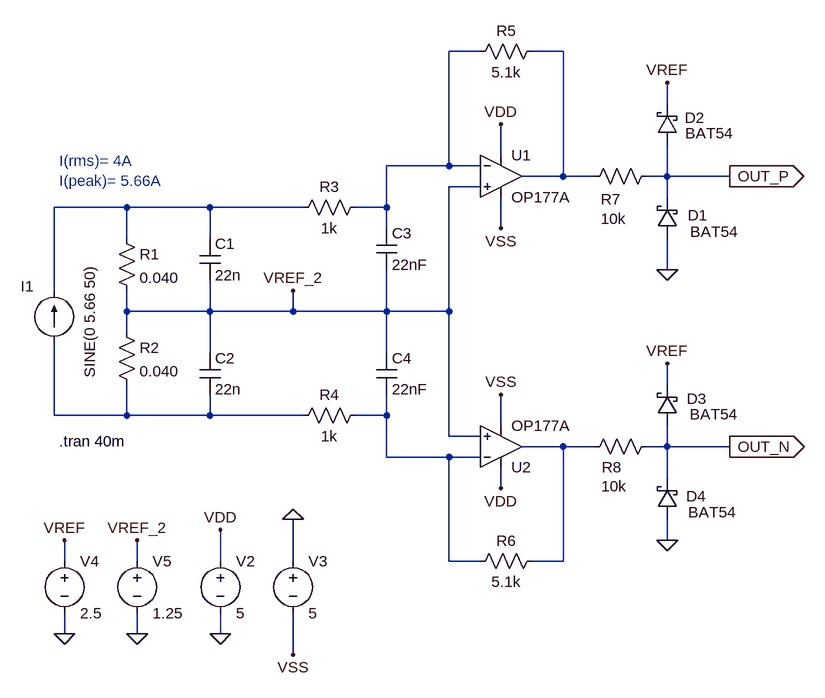
[diagram p0: schematic v1.0.asc]
v1.0.asc, the LTspice schematic file:
Version 4.1
SHEET 1 1828 1004
WIRE 800 -208 752 -208
WIRE 928 -208 880 -208
WIRE 1088 -128 1088 -160
WIRE 832 -48 832 -96
WIRE 752 -32 752 -208
WIRE 752 -32 656 -32
WIRE 800 -32 752 -32
WIRE 928 -16 928 -208
WIRE 928 -16 864 -16
WIRE 976 -16 928 -16
WIRE 1088 -16 1088 -64
WIRE 1088 -16 1056 -16
WIRE 1184 -16 1088 -16
WIRE 800 0 752 0
WIRE 1088 16 1088 -16
WIRE 256 32 144 32
WIRE 384 32 256 32
WIRE 528 32 384 32
WIRE 656 32 656 -32
WIRE 656 32 608 32
WIRE 656 64 656 32
WIRE 832 64 832 16
WIRE 256 80 256 32
WIRE 384 80 384 32
WIRE 1088 128 1088 80
WIRE 144 160 144 32
WIRE 256 192 256 160
WIRE 384 192 384 144
WIRE 384 192 256 192
WIRE 512 192 512 160
WIRE 512 192 384 192
WIRE 656 192 656 128
WIRE 656 192 512 192
WIRE 752 192 752 0
WIRE 752 192 656 192
WIRE 256 224 256 192
WIRE 384 256 384 192
WIRE 656 256 656 192
WIRE 1088 304 1088 272
WIRE 144 352 144 240
WIRE 256 352 256 304
WIRE 256 352 144 352
WIRE 384 352 384 320
WIRE 384 352 256 352
WIRE 528 352 384 352
WIRE 656 352 656 320
WIRE 656 352 608 352
WIRE 832 368 832 320
WIRE 752 384 752 192
WIRE 800 384 752 384
WIRE 928 400 864 400
WIRE 976 400 928 400
WIRE 1088 400 1088 368
WIRE 1088 400 1056 400
WIRE 1184 400 1088 400
WIRE 656 416 656 352
WIRE 752 416 656 416
WIRE 800 416 752 416
WIRE 1088 448 1088 400
WIRE 832 464 832 432
WIRE 1088 544 1088 512
WIRE 160 576 160 544
WIRE 272 576 272 544
WIRE 400 576 400 528
WIRE 512 576 512 512
WIRE 752 576 752 416
WIRE 800 576 752 576
WIRE 928 576 928 400
WIRE 928 576 880 576
WIRE 160 688 160 656
WIRE 272 688 272 656
WIRE 400 688 400 656
WIRE 512 720 512 656
FLAG 1184 -16 OUT_P
IOPIN 1184 -16 Out
FLAG 1184 400 OUT_N
IOPIN 1184 400 Out
FLAG 400 688 0
FLAG 400 528 VDD
FLAG 832 -96 VDD
FLAG 832 464 VDD
FLAG 512 720 VSS
FLAG 832 64 VSS
FLAG 832 320 VSS
FLAG 1088 544 0
FLAG 1088 128 0
FLAG 160 688 0
FLAG 160 544 VREF
FLAG 272 688 0
FLAG 272 544 VREF_2
FLAG 512 160 VREF_2
FLAG 1088 -160 VREF
FLAG 1088 272 VREF
FLAG 512 512 0
SYMBOL current 144 240 R180
WINDOW 0 31 87 Left 2
WINDOW 3 -55 -54 VRight 2
WINDOW 123 0 0 Left 0
WINDOW 39 0 0 Left 0
SYMATTR InstName I1
SYMATTR Value SINE(0 5.66 50)
SYMBOL res 240 64 R0
SYMATTR InstName R1
SYMATTR Value 0.040
SYMBOL res 240 208 R0
SYMATTR InstName R2
SYMATTR Value 0.040
SYMBOL cap 368 80 R0
SYMATTR InstName C1
SYMATTR Value 22n
SYMBOL cap 368 256 R0
SYMATTR InstName C2
SYMATTR Value 22n
SYMBOL res 624 16 R90
WINDOW 0 0 56 VBottom 2
WINDOW 3 32 56 VTop 2
SYMATTR InstName R3
SYMATTR Value 1k
SYMBOL res 624 336 R90
WINDOW 0 0 56 VBottom 2
WINDOW 3 32 56 VTop 2
SYMATTR InstName R4
SYMATTR Value 1k
SYMBOL cap 640 64 R0
SYMATTR InstName C3
SYMATTR Value 22nF
SYMBOL cap 640 256 R0
SYMATTR InstName C4
SYMATTR Value 22nF
SYMBOL OpAmps\\OP177A 832 -80 R0
SYMATTR InstName U1
SYMBOL OpAmps\\OP177A 832 464 M180
SYMATTR InstName U2
SYMBOL voltage 400 560 R0
WINDOW 123 0 0 Left 0
WINDOW 39 0 0 Left 0
SYMATTR InstName V2
SYMATTR Value 5
SYMBOL voltage 512 560 R0
WINDOW 123 0 0 Left 0
WINDOW 39 0 0 Left 0
SYMATTR InstName V3
SYMATTR Value 5
SYMBOL res 896 -224 R90
WINDOW 0 0 56 VBottom 2
WINDOW 3 32 56 VTop 2
SYMATTR InstName R5
SYMATTR Value 5.1k
SYMBOL res 896 560 R90
WINDOW 0 0 56 VBottom 2
WINDOW 3 32 56 VTop 2
SYMATTR InstName R6
SYMATTR Value 5.1k
SYMBOL res 1072 -32 R90
WINDOW 0 67 71 VBottom 2
WINDOW 3 66 67 VTop 2
SYMATTR InstName R7
SYMATTR Value 10k
SYMBOL res 1072 384 R90
WINDOW 0 63 69 VBottom 2
WINDOW 3 61 66 VTop 2
SYMATTR InstName R8
SYMATTR Value 10k
SYMBOL schottky 1104 512 R180
WINDOW 0 -44 36 Left 2
WINDOW 3 -90 11 Left 2
SYMATTR InstName D4
SYMATTR Value BAT54
SYMBOL schottky 1104 80 R180
WINDOW 0 -46 36 Left 2
WINDOW 3 -93 11 Left 2
SYMATTR InstName D1
SYMATTR Value BAT54
SYMBOL voltage 160 560 R0
WINDOW 123 0 0 Left 0
WINDOW 39 0 0 Left 0
SYMATTR InstName V4
SYMATTR Value 2.5
SYMBOL voltage 272 560 R0
WINDOW 123 0 0 Left 0
WINDOW 39 0 0 Left 0
SYMATTR InstName V5
SYMATTR Value 1.25
SYMBOL schottky 1104 -64 R180
WINDOW 0 -42 42 Left 2
WINDOW 3 -85 18 Left 2
SYMATTR InstName D2
SYMATTR Value BAT54
SYMBOL schottky 1104 368 R180
WINDOW 0 -45 42 Left 2
WINDOW 3 -92 18 Left 2
SYMATTR InstName D3
SYMATTR Value BAT54
TEXT 152 392 Left 2 !.tran 40m
TEXT 152 -40 Left 2 ;I(rms)= 4A\nI(peak)= 5.66A

The netlist it stands for:
* v1.0.asc
I1 N004 N003 SINE(0 5.66 50)
R1 N003 VREF_2 0.040
R2 VREF_2 N004 0.040
C1 N003 VREF_2 22n
C2 VREF_2 N004 22n
R3 N001 N003 1k
R4 N005 N004 1k
C3 N001 VREF_2 22nF
C4 VREF_2 N005 22nF
X§U1 VREF_2 N001 VDD VSS N002 OP177A  ; pins In+ In- V+ V- OUT
X§U2 VREF_2 N005 VDD VSS N006 OP177A  ; pins In+ In- V+ V- OUT
V2 VDD 0 5
V3 0 VSS 5
R5 N002 N001 5.1k
R6 N006 N005 5.1k
R7 OUT_P N002 10k
R8 OUT_N N006 10k
D4 0 OUT_N BAT54
D1 0 OUT_P BAT54
V4 VREF 0 2.5
V5 VREF_2 0 1.25
D2 OUT_P VREF BAT54
D3 OUT_N VREF BAT54
.model D D
.lib standard.dio
.tran 40m
* I(rms)= 4A
* I(peak)= 5.66A
.backanno
.end